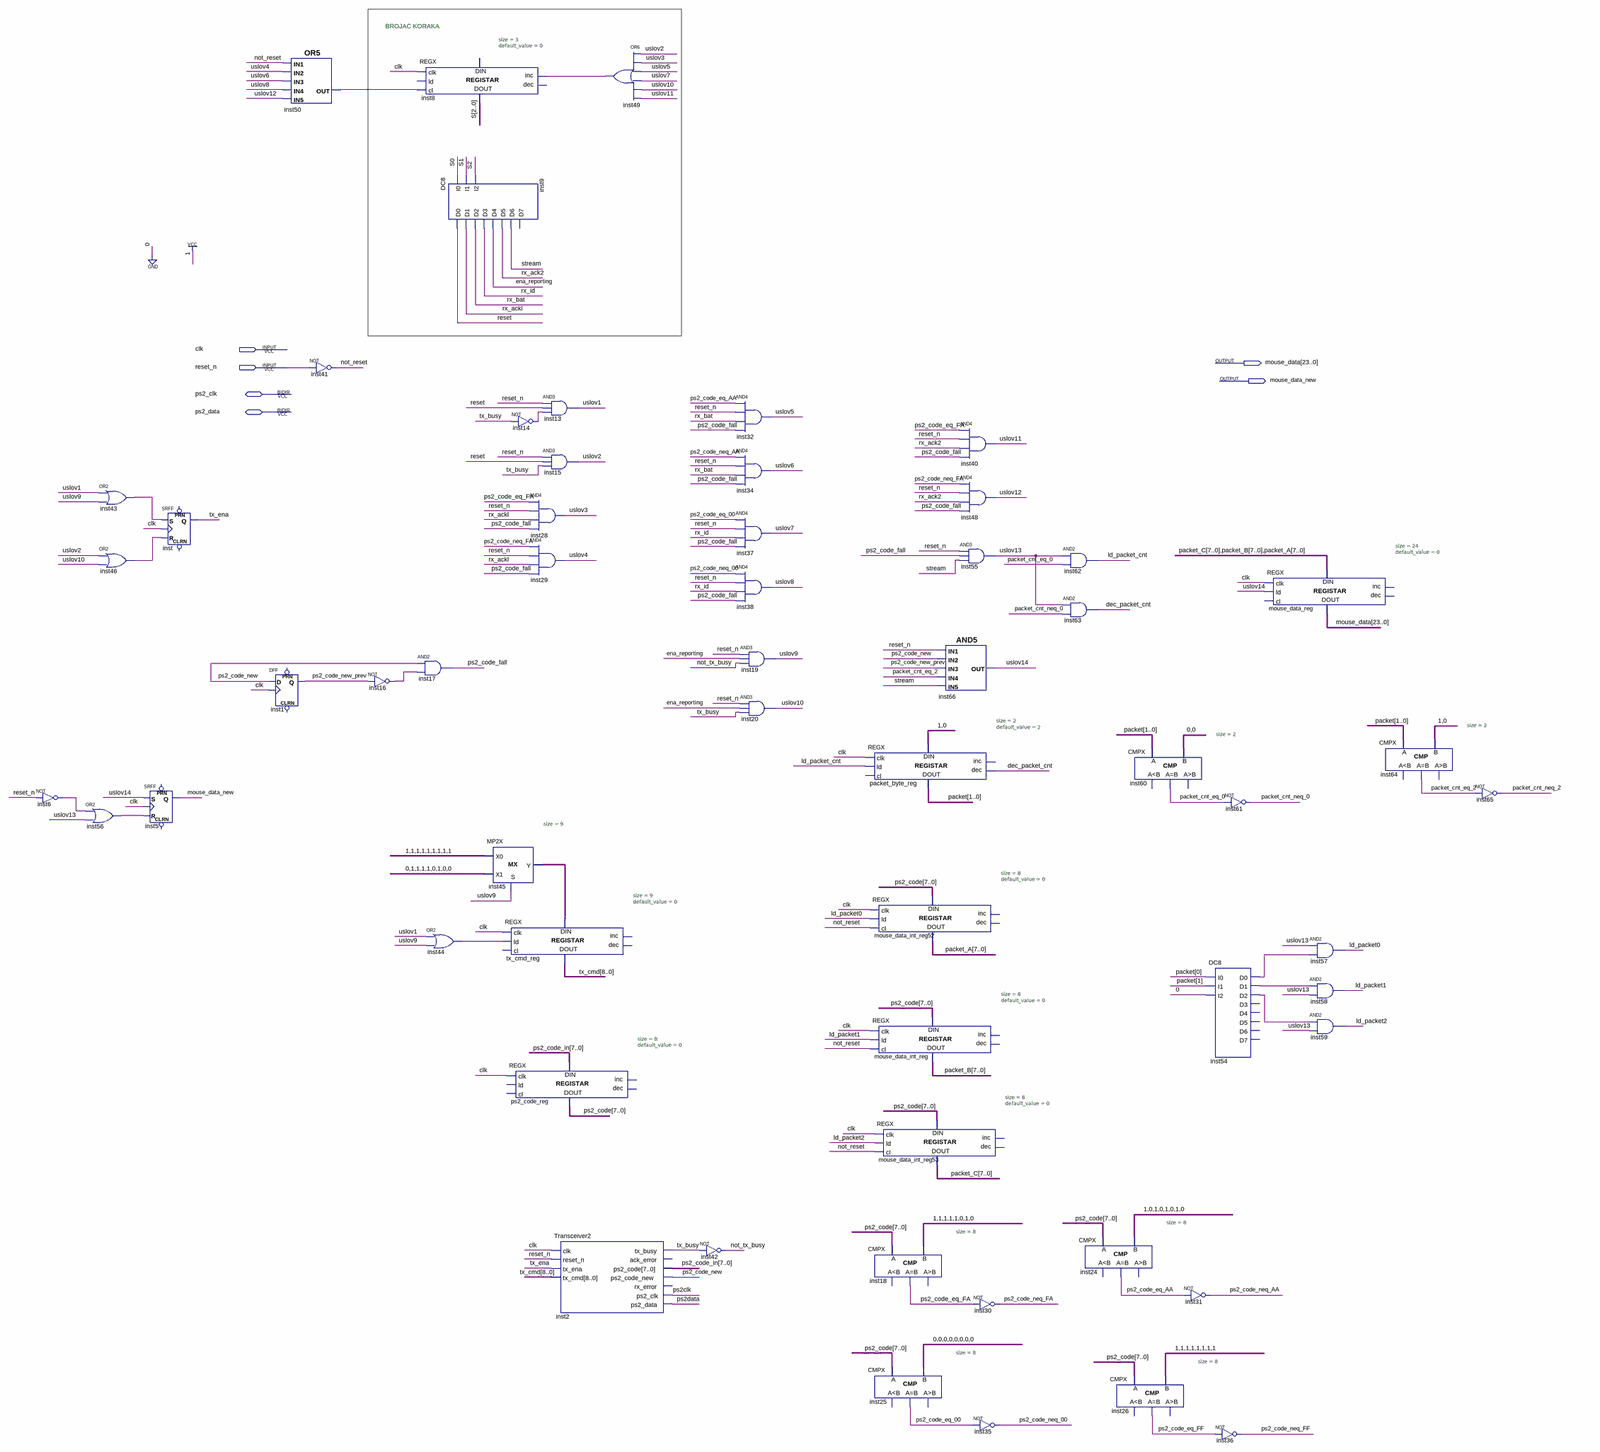
[diagram p0: schematic sheet, whole]
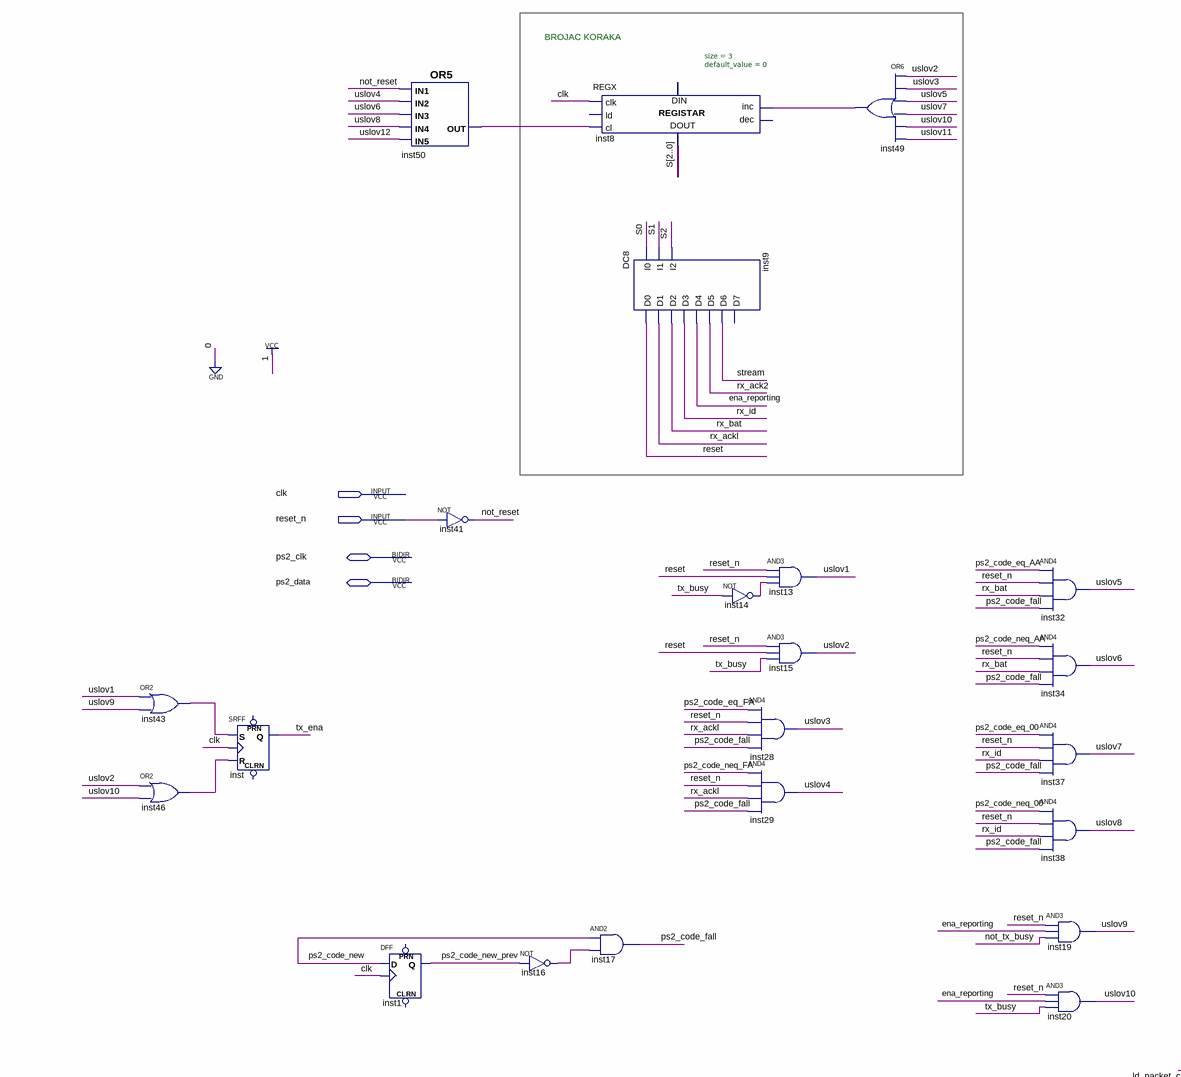
[diagram p1: schematic sheet, upper left part]
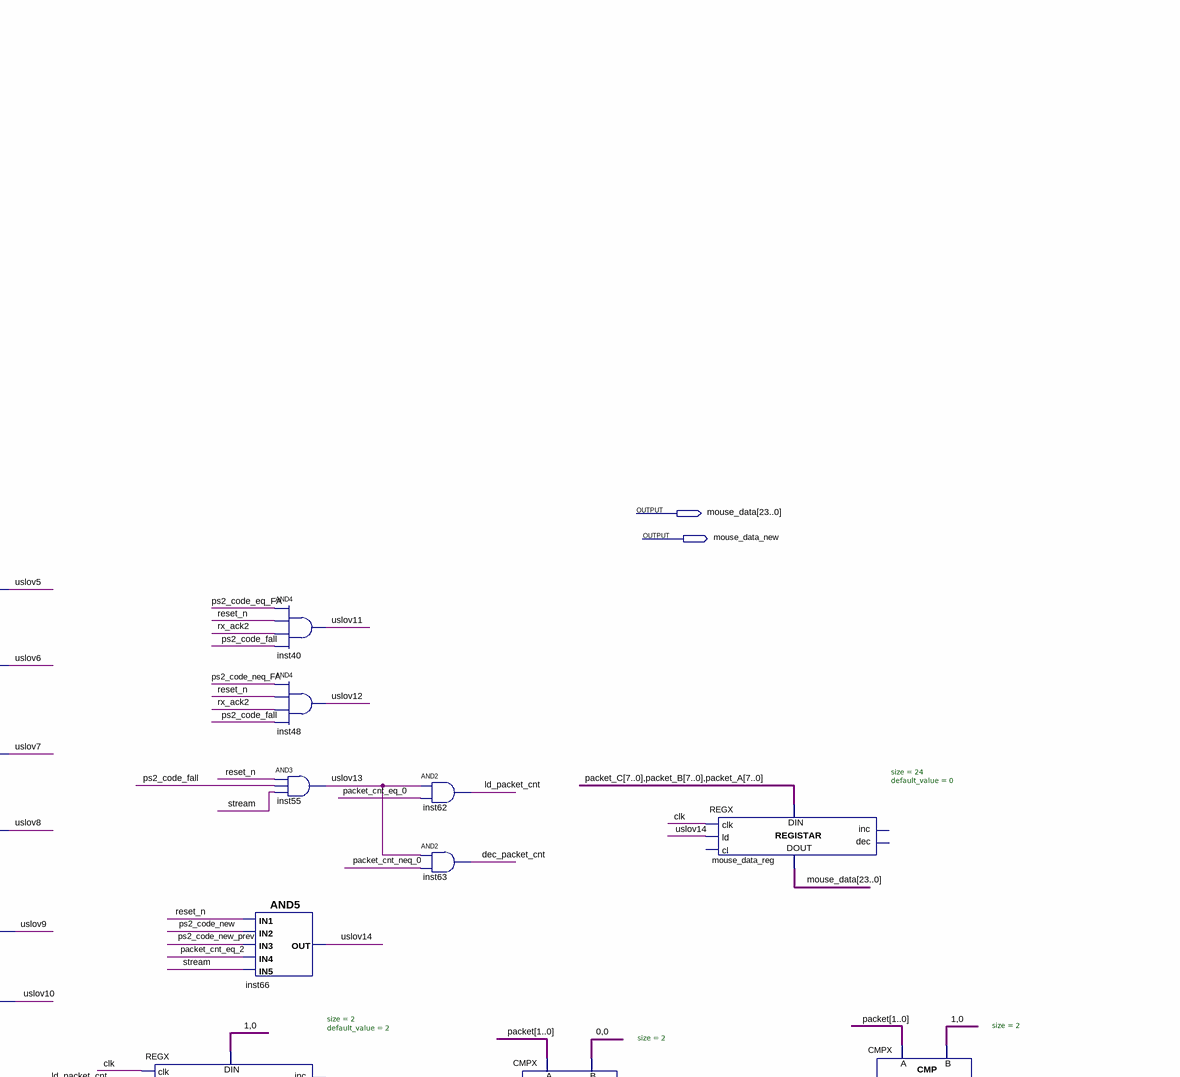
[diagram p2: schematic sheet, upper right part]
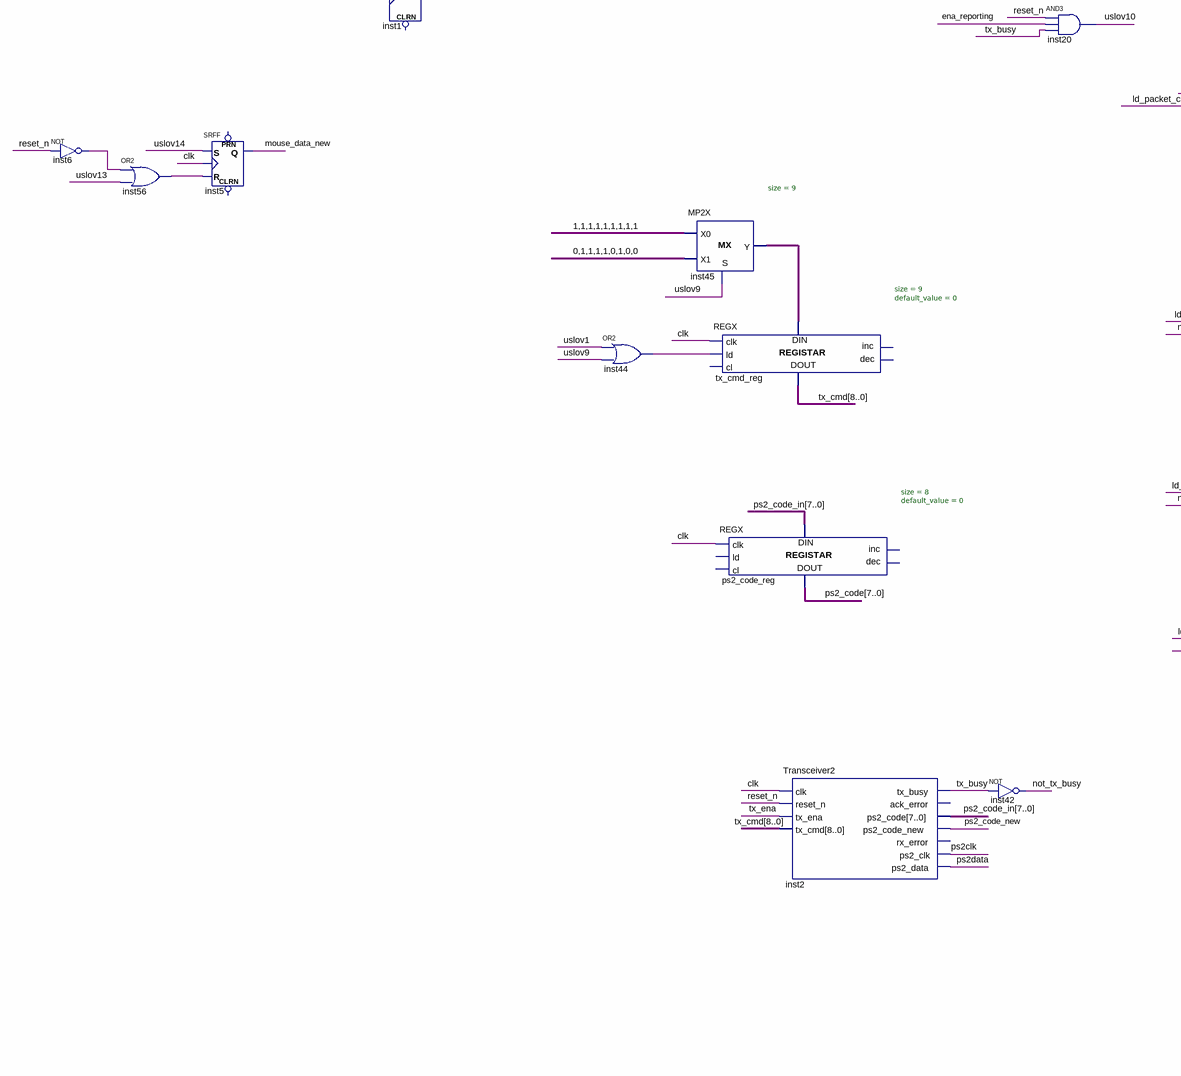
[diagram p3: schematic sheet, lower left part]
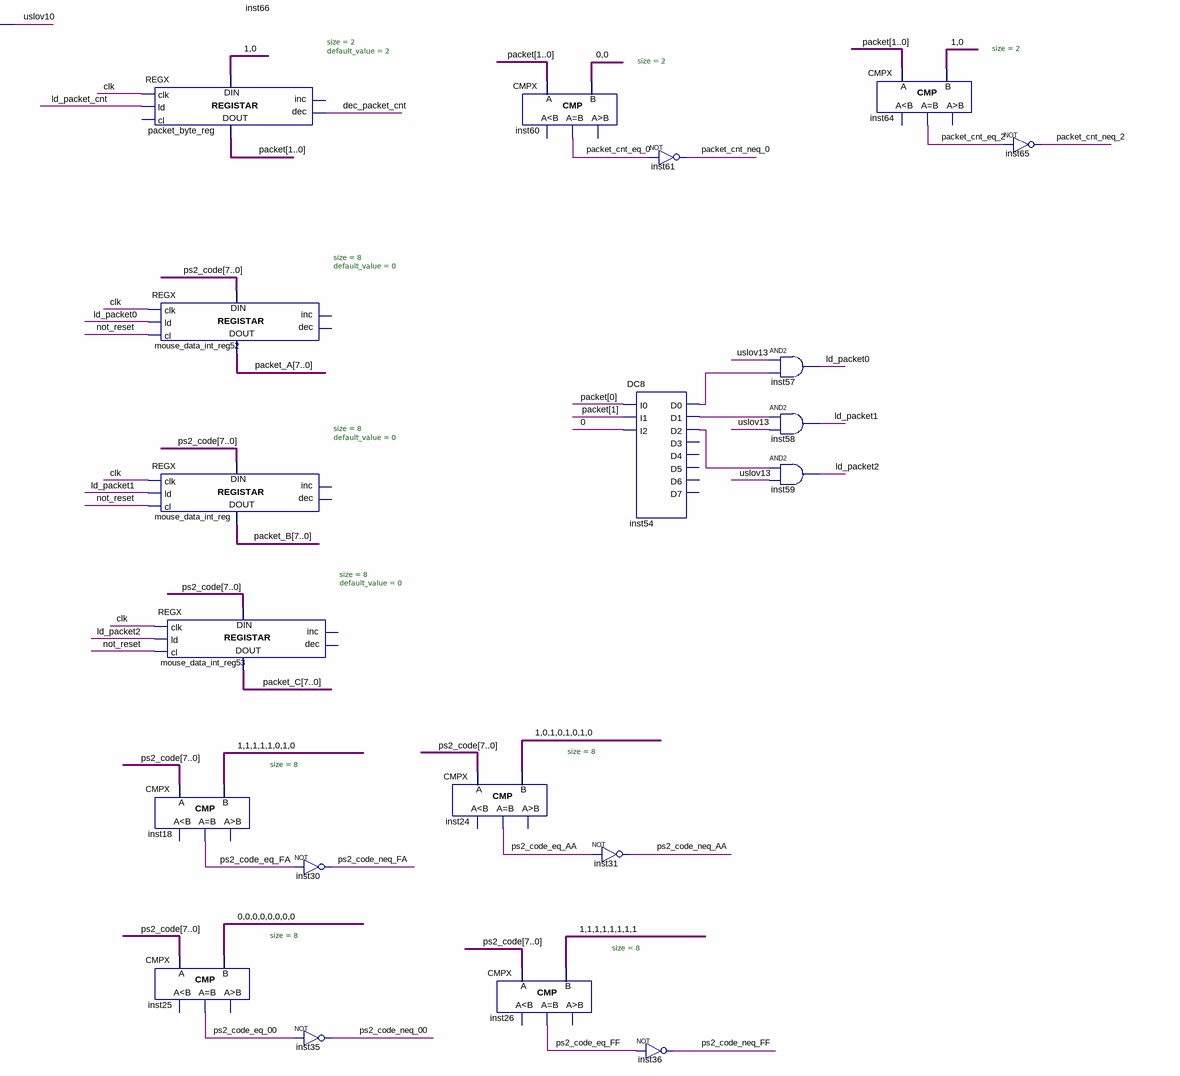
[diagram p4: schematic sheet, lower right part]
// Quartus schematic MouseInterface2.bdf as structural Verilog: 58 symbols, 6 pins
module MouseInterface2 (
  input  clk,
  input  reset_n,
  inout  ps2_clk,
  inout  ps2_data,
  output [23:0] mouse_data,
  output mouse_data_new
);

  wire dec_packet_cnt, ena_reporting, inst6_out, inst14_out, inst16_out, inst43_out, inst44_out, inst46_out,
       inst49_out, inst50_out, inst54_d0, inst54_d1, inst54_d2, inst56_out, ld_packet0, ld_packet1,
       ld_packet2, ld_packet_cnt, not_reset, not_tx_busy, packet_cnt_eq_0, packet_cnt_eq_2, packet_cnt_neq_0,
       packet_cnt_neq_2, ps2_code_eq_00, ps2_code_eq_AA, ps2_code_eq_FA, ps2_code_eq_FF, ps2_code_fall,
       ps2_code_neq_00, ps2_code_neq_AA, ps2_code_neq_FA, ps2_code_neq_FF, ps2_code_new, ps2_code_new_prev,
       ps2clk, ps2data, reset, rx_ack2, rx_ackl, rx_bat, rx_id, stream, tx_busy, tx_ena, uslov1, uslov2,
       uslov3, uslov4, uslov5, uslov6, uslov7, uslov8, uslov9, uslov10, uslov11, uslov12, uslov13, uslov14;
  wire [1:0] packet;
  wire [2:0] S;
  wire [7:0] packet_A, packet_B, packet_C, ps2_code, ps2_code_in;
  wire [8:0] inst45_y, tx_cmd;

  not inst6 (inst6_out, reset_n);
  or inst43 (inst43_out, uslov1, uslov9);
  or inst46 (inst46_out, uslov2, uslov10);
  or inst56 (inst56_out, inst6_out, uslov13);
  SRFF inst (.S(inst43_out), .R(inst46_out), .CLK(clk), .Q(tx_ena));  // open: PRN, CLRN
  SRFF inst5 (.S(uslov14), .R(inst56_out), .CLK(clk), .Q(mouse_data_new));  // open: PRN, CLRN
  or inst50 (inst50_out, not_reset, uslov4, uslov6, uslov8, uslov12);
  DFF inst1 (.CLK(clk), .D(ps2_code_new), .Q(ps2_code_new_prev));  // open: CLRN, PRN
  not inst41 (not_reset, reset_n);
  not inst16 (inst16_out, ps2_code_new_prev);
  REGX #(.size(3), .default_value(0)) inst8 (
    .clk(clk), .cl(inst50_out), .inc(inst49_out), .data_out(S));  // open: ld, dec, data_in
  and inst17 (ps2_code_fall, ps2_code_new, inst16_out);
  or inst44 (inst44_out, uslov1, uslov9);
  DC8 inst9 (
    .I0(S[0]), .I1(S[1]), .I2(S[2]), .D0(reset), .D1(rx_ackl), .D2(rx_bat), .D3(rx_id), .D4(ena_reporting),
    .D5(rx_ack2), .D6(stream));  // open: D7
  MP2X #(.size(9)) inst45 (.S(uslov9), .X0({9{1'b1}}), .X1(9'b011110100), .Y(inst45_y));
  not inst14 (inst14_out, tx_busy);
  and inst28 (uslov3, ps2_code_eq_FA, reset_n, rx_ackl, ps2_code_fall);
  and inst29 (uslov4, ps2_code_neq_FA, reset_n, rx_ackl, ps2_code_fall);
  REGX #(.size(9), .default_value(0)) tx_cmd_reg (
    .clk(clk), .ld(inst44_out), .data_in(inst45_y), .data_out(tx_cmd));  // open: cl, inc, dec
  REGX #(.size(8), .default_value(0)) ps2_code_reg (
    .clk(clk), .data_in(ps2_code_in), .data_out(ps2_code));  // open: ld, cl, inc, dec
  and inst13 (uslov1, reset_n, reset, inst14_out);
  and inst15 (uslov2, reset_n, reset, tx_busy);
  Transceiver2 inst2 (
    .clk(clk), .reset_n(reset_n), .tx_ena(tx_ena), .tx_cmd(tx_cmd), .tx_busy(tx_busy),
    .ps2_code(ps2_code_in), .ps2_code_new(ps2_code_new), .ps2_clk(ps2clk), .ps2_data(ps2data));  // open: ack_error, rx_error
  or inst49 (inst49_out, uslov2, uslov3, uslov5, uslov7, uslov10, uslov11);
  not inst42 (not_tx_busy, tx_busy);
  and inst32 (uslov5, ps2_code_eq_AA, reset_n, rx_bat, ps2_code_fall);
  and inst34 (uslov6, ps2_code_neq_AA, reset_n, rx_bat, ps2_code_fall);
  and inst37 (uslov7, ps2_code_eq_00, reset_n, rx_id, ps2_code_fall);
  and inst38 (uslov8, ps2_code_neq_00, reset_n, rx_id, ps2_code_fall);
  and inst19 (uslov9, reset_n, ena_reporting, not_tx_busy);
  and inst20 (uslov10, reset_n, ena_reporting, tx_busy);
  REGX #(.size(2), .default_value(2)) packet_byte_reg (
    .clk(clk), .ld(ld_packet_cnt), .dec(dec_packet_cnt), .data_in(2'b10), .data_out(packet));  // open: cl, inc
  REGX #(.size(8), .default_value(0)) mouse_data_int_reg52 (
    .clk(clk), .ld(ld_packet0), .cl(not_reset), .data_in(ps2_code), .data_out(packet_A));  // open: inc, dec
  REGX #(.size(8), .default_value(0)) mouse_data_int_reg (
    .clk(clk), .ld(ld_packet1), .cl(not_reset), .data_in(ps2_code), .data_out(packet_B));  // open: inc, dec
  REGX #(.size(8), .default_value(0)) mouse_data_int_reg53 (
    .clk(clk), .ld(ld_packet2), .cl(not_reset), .data_in(ps2_code), .data_out(packet_C));  // open: inc, dec
  CMPX #(.size(8)) inst18 (.A(ps2_code), .B(8'b11111010), .eq(ps2_code_eq_FA));  // open: ls, gr
  CMPX #(.size(8)) inst25 (.A(ps2_code), .B({8{1'b0}}), .eq(ps2_code_eq_00));  // open: ls, gr
  and inst40 (uslov11, ps2_code_eq_FA, reset_n, rx_ack2, ps2_code_fall);
  and inst48 (uslov12, ps2_code_neq_FA, reset_n, rx_ack2, ps2_code_fall);
  and inst55 (uslov13, reset_n, ps2_code_fall, stream);
  and inst66 (uslov14, reset_n, ps2_code_new, ps2_code_new_prev, packet_cnt_eq_2, stream);
  not inst30 (ps2_code_neq_FA, ps2_code_eq_FA);
  not inst35 (ps2_code_neq_00, ps2_code_eq_00);
  and inst62 (ld_packet_cnt, uslov13, packet_cnt_eq_0);
  and inst63 (dec_packet_cnt, uslov13, packet_cnt_neq_0);
  CMPX #(.size(8)) inst24 (.A(ps2_code), .B(8'b10101010), .eq(ps2_code_eq_AA));  // open: ls, gr
  CMPX #(.size(8)) inst26 (.A(ps2_code), .B({8{1'b1}}), .eq(ps2_code_eq_FF));  // open: ls, gr
  CMPX #(.size(2)) inst60 (.A(packet), .B(2'b00), .eq(packet_cnt_eq_0));  // open: ls, gr
  DC8 inst54 (
    .I0(packet[0]), .I1(packet[1]), .I2(1'b0), .D0(inst54_d0), .D1(inst54_d1), .D2(inst54_d2));  // open: D3, D4, D5, D6, D7
  not inst31 (ps2_code_neq_AA, ps2_code_eq_AA);
  not inst36 (ps2_code_neq_FF, ps2_code_eq_FF);
  not inst61 (packet_cnt_neq_0, packet_cnt_eq_0);
  REGX #(.size(24), .default_value(0)) mouse_data_reg (
    .clk(clk), .ld(uslov14), .data_in({packet_C, packet_B, packet_A}), .data_out(mouse_data));  // open: cl, inc, dec
  and inst57 (ld_packet0, uslov13, inst54_d0);
  and inst58 (ld_packet1, inst54_d1, uslov13);
  and inst59 (ld_packet2, inst54_d2, uslov13);
  CMPX #(.size(2)) inst64 (.A(packet), .B(2'b10), .eq(packet_cnt_eq_2));  // open: ls, gr
  not inst65 (packet_cnt_neq_2, packet_cnt_eq_2);

  // Notes on the sheet:
  //   BROJAC KORAKA
endmodule
